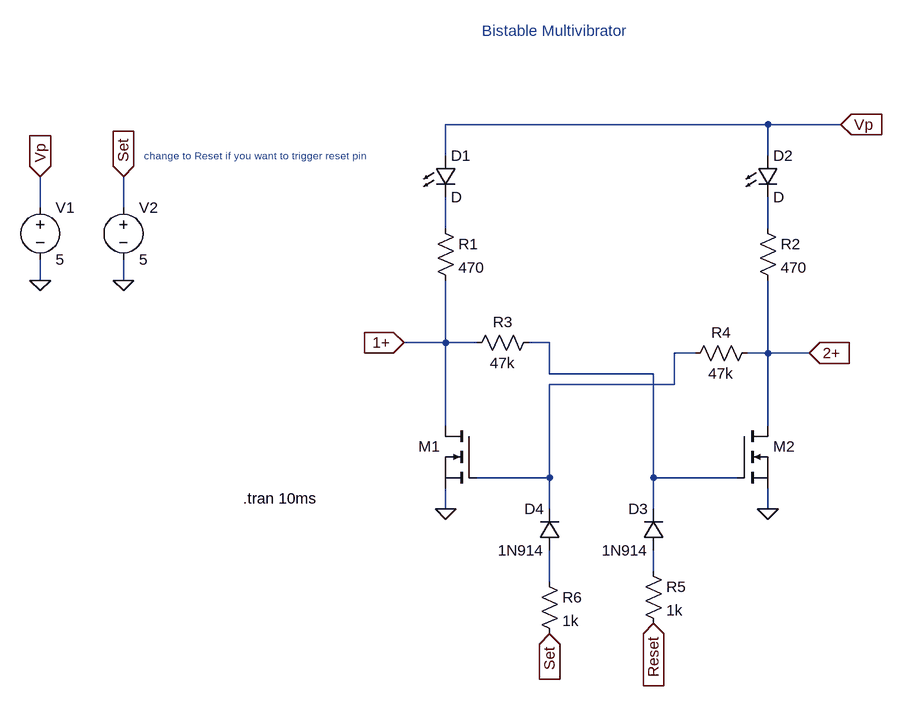
[diagram p0: schematic bistable_multivib_ltspice.asc]
bistable_multivib_ltspice.asc, the LTspice schematic file:
Version 4
SHEET 1 880 680
WIRE 592 -608 96 -608
WIRE 704 -608 592 -608
WIRE 96 -560 96 -608
WIRE 592 -560 592 -608
WIRE -528 -480 -528 -528
WIRE -400 -480 -400 -528
WIRE 96 -448 96 -496
WIRE 592 -448 592 -496
WIRE -528 -368 -528 -400
WIRE -400 -368 -400 -400
WIRE 96 -272 96 -368
WIRE 96 -272 32 -272
WIRE 144 -272 96 -272
WIRE 256 -272 224 -272
WIRE 480 -256 448 -256
WIRE 592 -256 592 -368
WIRE 592 -256 560 -256
WIRE 656 -256 592 -256
WIRE 256 -224 256 -272
WIRE 416 -224 256 -224
WIRE 448 -208 448 -256
WIRE 448 -208 256 -208
WIRE 96 -144 96 -272
WIRE 592 -144 592 -256
WIRE 256 -64 256 -208
WIRE 256 -64 144 -64
WIRE 416 -64 416 -224
WIRE 544 -64 416 -64
WIRE 96 -16 96 -48
WIRE 256 -16 256 -64
WIRE 416 -16 416 -64
WIRE 592 -16 592 -48
WIRE 416 80 416 48
WIRE 256 96 256 48
FLAG 96 -16 0
FLAG 592 -16 0
FLAG 704 -608 Vp
IOPIN 704 -608 In
FLAG 32 -272 1+
IOPIN 32 -272 In
FLAG 656 -256 2+
IOPIN 656 -256 In
FLAG -528 -368 0
FLAG -528 -528 Vp
IOPIN -528 -528 In
FLAG 256 176 Set
IOPIN 256 176 In
FLAG -400 -368 0
FLAG -400 -528 Set
IOPIN -400 -528 In
FLAG 416 160 Reset
IOPIN 416 160 In
SYMBOL res 80 -464 R0
SYMATTR InstName R1
SYMATTR Value 470
SYMBOL res 576 -464 R0
SYMATTR InstName R2
SYMATTR Value 470
SYMBOL LED 80 -560 R0
SYMATTR InstName D1
SYMBOL LED 576 -560 R0
SYMATTR InstName D2
SYMBOL voltage -528 -496 R0
WINDOW 123 0 0 Left 0
WINDOW 39 0 0 Left 0
SYMATTR InstName V1
SYMATTR Value 5
SYMBOL diode 432 48 R180
WINDOW 0 24 64 Left 2
WINDOW 3 24 0 Left 2
SYMATTR InstName D3
SYMATTR Value 1N914
SYMBOL res 400 64 R0
SYMATTR InstName R5
SYMATTR Value 1k
SYMBOL diode 272 48 R180
WINDOW 0 24 64 Left 2
WINDOW 3 24 0 Left 2
SYMATTR InstName D4
SYMATTR Value 1N914
SYMBOL res 240 80 R0
SYMATTR InstName R6
SYMATTR Value 1k
SYMBOL res 240 -288 R90
WINDOW 0 0 56 VBottom 2
WINDOW 3 32 56 VTop 2
SYMATTR InstName R3
SYMATTR Value 47k
SYMBOL res 576 -272 R90
WINDOW 0 0 56 VBottom 2
WINDOW 3 32 56 VTop 2
SYMATTR InstName R4
SYMATTR Value 47k
SYMBOL voltage -400 -496 R0
WINDOW 123 0 0 Left 0
WINDOW 39 0 0 Left 0
SYMATTR InstName V2
SYMATTR Value 5
SYMBOL nmos 144 -144 M0
WINDOW 3 56 72 Invisible 2
SYMATTR InstName M1
SYMATTR Value BSP89
SYMBOL nmos 544 -144 R0
WINDOW 3 56 72 Invisible 2
SYMATTR InstName M2
SYMATTR Value BSP89
TEXT -216 -32 Left 2 !.tran 10ms
TEXT 152 -752 Left 2 ;Bistable Multivibrator
TEXT -368 -560 Left 1 ;change to Reset if you want to trigger reset pin

The netlist it stands for:
* bistable_multivib_ltspice.asc
R1 N001 1+ 470
R2 N002 2+ 470
D1 Vp N001 D
D2 Vp N002 D
V1 Vp 0 5
D3 N005 N003 1N914
R5 N005 Reset 1k
D4 N006 N004 1N914
R6 N006 Set 1k
R3 N003 1+ 47k
R4 2+ N004 47k
V2 Set 0 5
M1 1+ N004 0 0 BSP89
M2 2+ N003 0 0 BSP89
.model D D
.lib standard.dio
.model NMOS NMOS
.model PMOS PMOS
.lib standard.mos
.tran 10ms
* Bistable Multivibrator
* change to Reset if you want to trigger reset pin
.backanno
.end